# Altium schematic sheet sch2.SchDoc
size A3; SheetNumber: 1; SheetTotal: 1
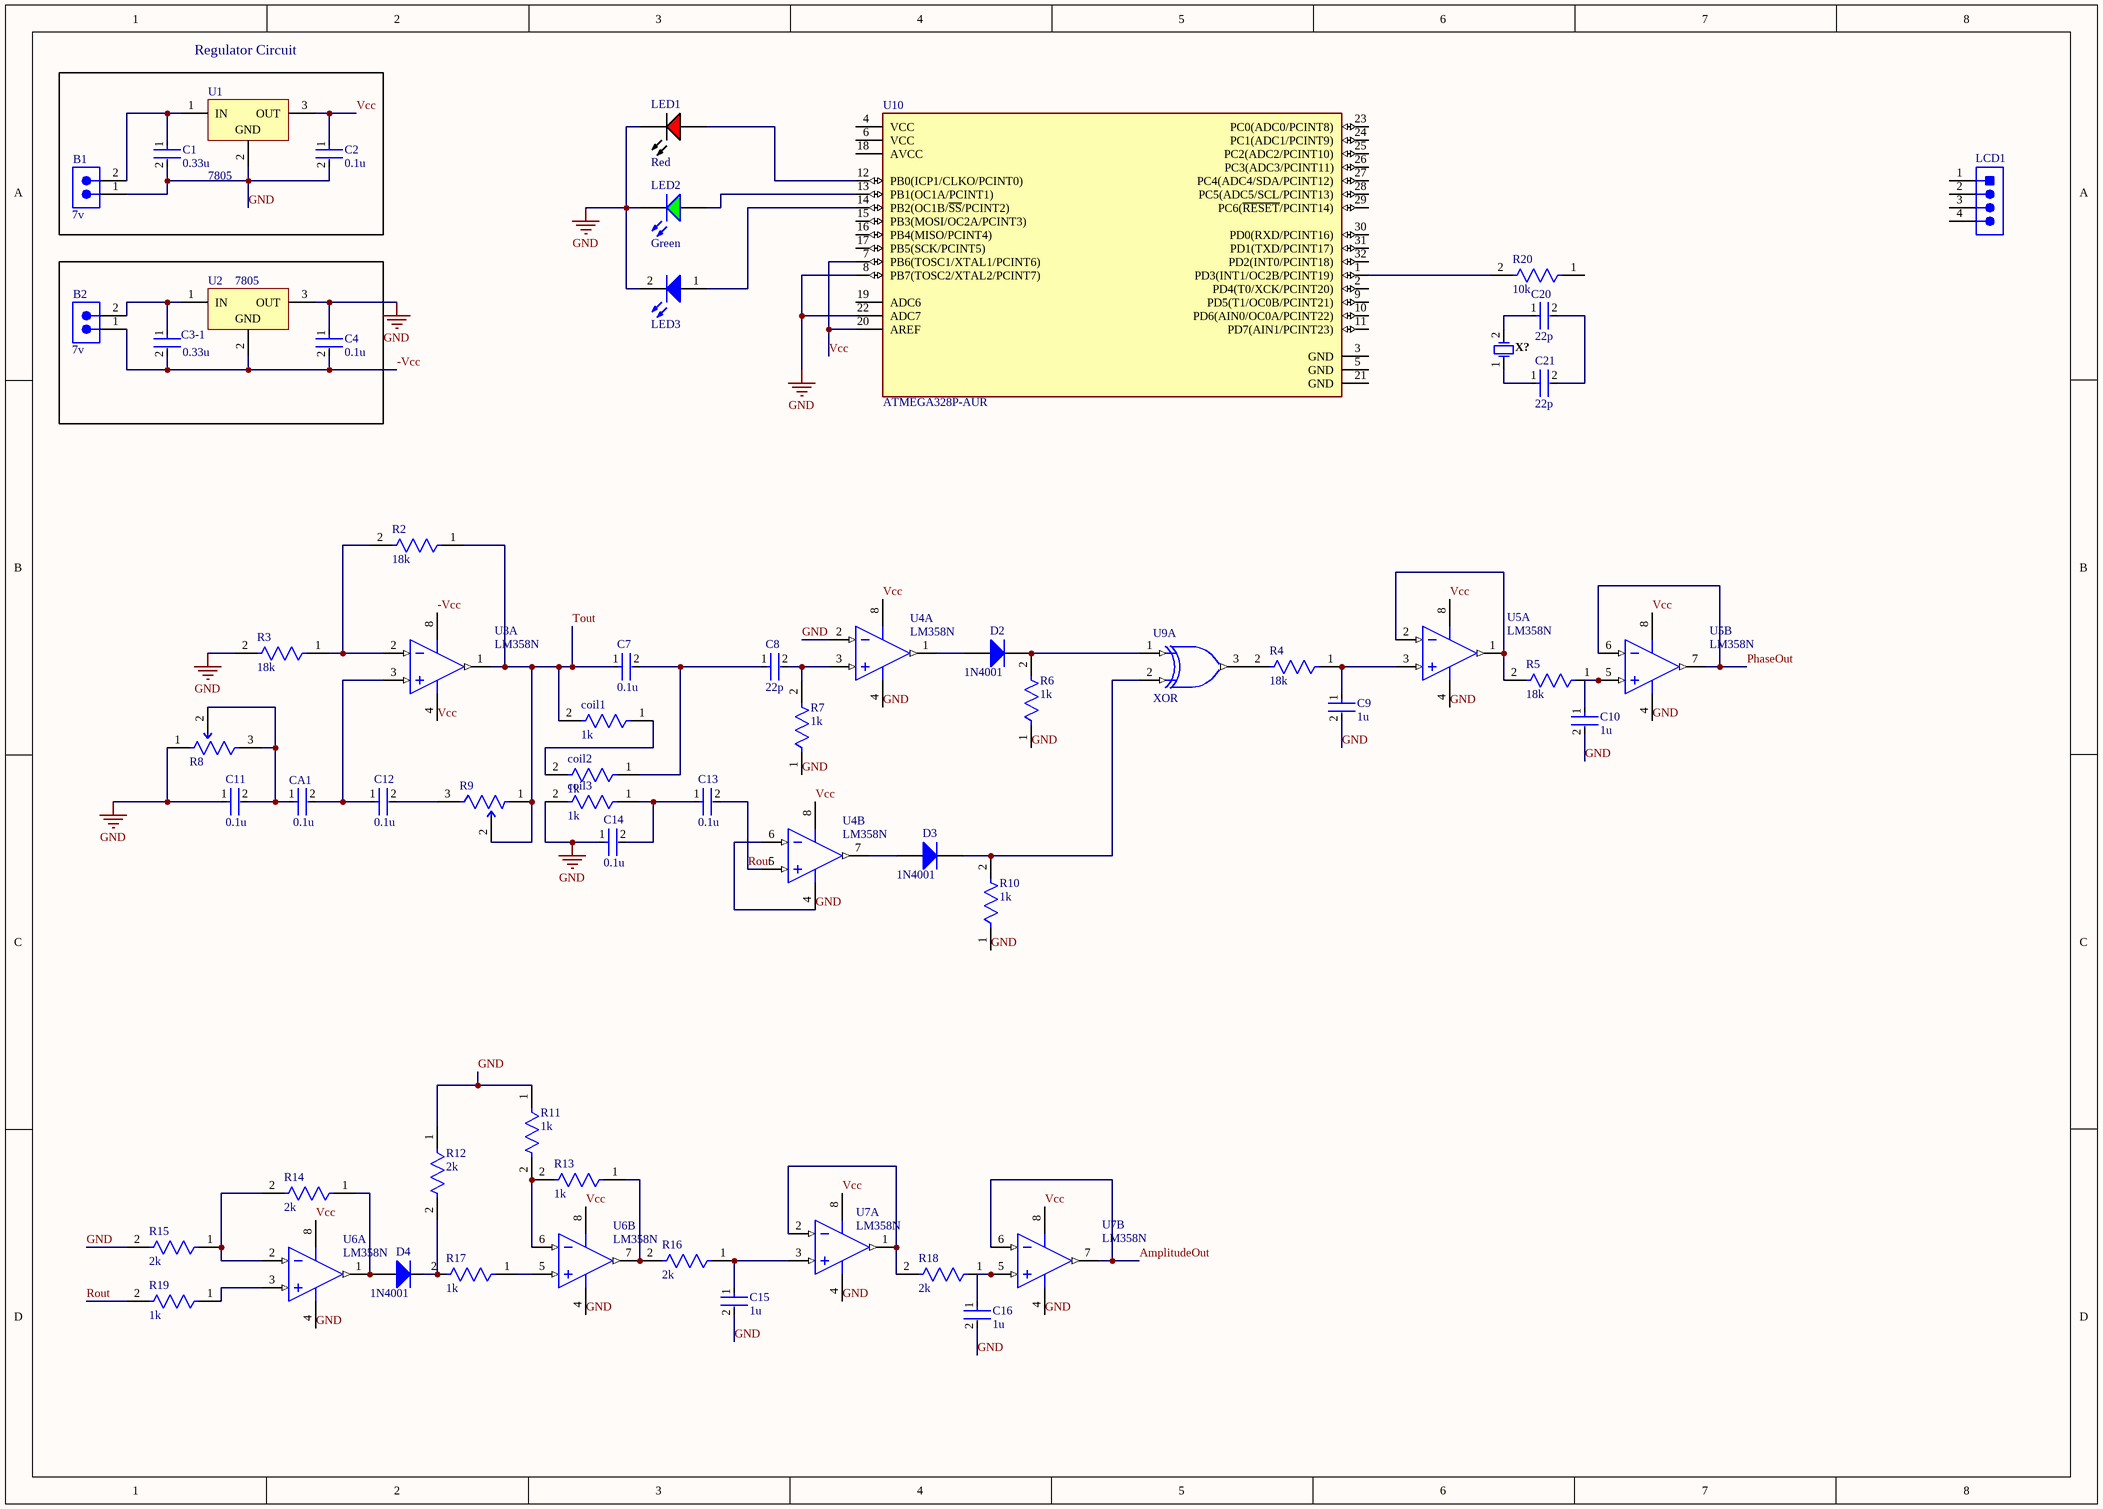
[diagram p0: sch2.SchDoc]

## Parts
B1  7v  [61300211121]
B2  7v  [61300211121]
C1  0.33u  [FP-RCE0K1-MFG]
C2  0.1u  [FP-RCE0K1-MFG]
C3-1  0.33u  [FP-RCE0K1-MFG]
C4  0.1u  [FP-RCE0K1-MFG]
C7  0.1u  [FP-RCE0K1-MFG]
C8  22p  [FP-RCE0K1-MFG]
C9  1u  [FP-RCE0K1-MFG]
C10  1u  [FP-RCE0K1-MFG]
C11  0.1u  [FP-RCE0K1-MFG]
C12  0.1u  [FP-RCE0K1-MFG]
C13  0.1u  [FP-RCE0K1-MFG]
C14  0.1u  [FP-RCE0K1-MFG]
C15  1u  [FP-RCE0K1-MFG]
C16  1u  [FP-RCE0K1-MFG]
C20  22p  [FP-RCE0K1-MFG]
C21  22p  [FP-RCE0K1-MFG]
CA1  0.1u  [FP-RCE0K1-MFG]
coil1  1k  [FP-MRS25-MFG]
coil2  1k  [FP-MRS25-MFG]
coil3  1k  [FP-MRS25-MFG]
D2  1N4001  [DIOD-DO-41-P-2_V]
D3  1N4001  [DIOD-DO-41-P-2_V]
D4  1N4001  [DIOD-DO-41-P-2_V]
LCD1  640456-4  [TECO-640456-4]  (value not drawn)
LED1  Red  [AVAG-HLMP-3301-2]
LED2  Green  [AVAG-HLMP-4740]
LED3  151051BS04000  [WL-TMRC_D5.9H8.7]  (value not drawn)
R2  18k  [FP-MRS25-MFG]
R3  18k  [FP-MRS25-MFG]
R4  18k  [FP-MRS25-MFG]
R5  18k  [FP-MRS25-MFG]
R6  1k  [FP-MRS25-MFG]
R7  1k  [FP-MRS25-MFG]
R8  3362P-1-104TLF  [FP-3362P-T-MFG]  (value not drawn)
R9  3362P-1-104TLF  [FP-3362P-T-MFG]  (value not drawn)
R10  1k  [FP-MRS25-MFG]
R11  1k  [FP-MRS25-MFG]
R12  2k  [FP-MRS25-MFG]
R13  1k  [FP-MRS25-MFG]
R14  2k  [FP-MRS25-MFG]
R15  2k  [FP-MRS25-MFG]
R16  2k  [FP-MRS25-MFG]
R17  1k  [FP-MRS25-MFG]
R18  2k  [FP-MRS25-MFG]
R19  1k  [FP-MRS25-MFG]
R20  10k  [FP-MRS25-MFG]
U1  7805  [TO220]
U2  7805  [TO220]
U3  LM358N  [N08E]  (part A of 2)
U4  LM358N  [P0008A]  (parts A,B of 2)
U5  LM358N  [P0008A]  (parts A,B of 2)
U6  LM358N  [P0008A]  (parts A,B of 2)
U7  LM358N  [P0008A]  (parts A,B of 2)
U9  XOR  [N0014A]  (part A of 5)
U10  ATMEGA328P-AUR  [FP-32A-MFG]
X?  FOXSLF/160-20  [FOX-FOXSLF160-20]  (value not drawn)

## Blocks framed on the sheet
Regulator Circuit: B1 C1 C2 U1

## Nets
GND: B1.1 C1.2 C2.2 C4.1 C9.2 C10.2 C11.1 C14.1 C15.2 C16.2 coil3.2 LED1.1(K) LED2.2(K) LED3.2(K) R3.2 R6.1 R7.1 R8.1(CCW) R10.1 R11.1 R12.1 R15.2 U1.2(GND) U2.3(OUT) U4.2(INA-) U4.4(GND) U4.6(INB-) U5.4(GND) U6.4(GND) U7.4(GND) U10.8(PB7(TOSC2/XTAL2/PCINT7)) U10.22(ADC7)
-Vcc: B2.1 C3-1.2 C4.2 U2.2(GND) U3.8(V+)
AmplitudeOut: U7.6(INB-) U7.7(OUTB)
PhaseOut: U5.6(INB-) U5.7(OUTB)
Rout: C13.2 R19.2 U4.5(INB+)
Tout: C7.1 coil1.2 R2.1 R9.1(CCW) R9.2(WIPER) U3.1(OUTA)
Vcc: C2.1 U1.3(OUT) U3.4(GND) U4.8(V+) U5.8(V+) U6.8(V+) U7.8(V+) U10.7(PB6(TOSC1/XTAL1/PCINT6)) U10.20(AREF)
NetB1_2: B1.2 C1.1 U1.1(IN)
NetB2_2: B2.2 C3-1.1 U2.1(IN)
NetC7_2: C7.2 C8.1 coil2.1
NetC8_2: C8.2 R7.2 U4.3(INA+)
NetC9_1: C9.1 R4.1 U5.3(INA+)
NetC10_1: C10.1 R5.1 U5.5(INB+)
NetC11_2: C11.2 CA1.1 R8.2(WIPER) R8.3(CW)
NetC12_1: C12.1 CA1.2 U3.3(INA+)
NetC12_2: C12.2 R9.3(CW)
NetC13_1: C13.1 C14.2 coil3.1
NetC15_1: C15.1 R16.1 U7.3(INA+)
NetC16_1: C16.1 R18.1 U7.5(INB+)
NetC20_1: C20.1 X?.2
NetC20_2: C20.2 C21.2
NetC21_1: C21.1 X?.1
Netcoil1_1: coil1.1 coil2.2
NetD2_1: D2.1(A) U4.1(OUTA)
NetD2_2: D2.2(K) R6.2 U9.1(A)
NetD3_1: D3.1(A) U4.7(OUTB)
NetD3_2: D3.2(K) R10.2 U9.2(B)
NetD4_1: D4.1(A) R14.1 U6.1(OUTA)
NetD4_2: D4.2(K) R12.2 R17.2
NetLED1_2: LED1.2(A) U10.12(PB0(ICP1/CLKO/PCINT0))
NetLED2_1: LED2.1(A) U10.13(PB1(OC1A/PCINT1))
NetLED3_1: LED3.1(A) U10.14(PB2(OC1B/~{SS}/PCINT2))
NetR2_2: R2.2 R3.1 U3.2(INA-)
NetR4_2: R4.2 U9.3(J)
NetR5_2: R5.2 U5.1(OUTA) U5.2(INA-)
NetR11_2: R11.2 R13.2 U6.6(INB-)
NetR13_1: R13.1 R16.2 U6.7(OUTB)
NetR14_2: R14.2 R15.1 U6.2(INA-)
NetR17_1: R17.1 U6.5(INB+)
NetR18_2: R18.2 U7.1(OUTA) U7.2(INA-)
NetR19_1: R19.1 U6.3(INA+)
NetR20_2: R20.2 U10.1(PD3(INT1/OC2B/PCINT19))

Not connected (* = marked no-connect by the designer): LCD1 1 2 3 4; R20 1; U10 2(PD4(T0/XCK/PCINT20)) 3(GND) 4(VCC) 5(GND) 6(VCC) 9(PD5(T1/OC0B/PCINT21)) 10(PD6(AIN0/OC0A/PCINT22)) 11(PD7(AIN1/PCINT23)) 15(PB3(MOSI/OC2A/PCINT3)) 16(PB4(MISO/PCINT4)) 17(PB5(SCK/PCINT5)) 18(AVCC) 19(ADC6) 21(GND) 23(PC0(ADC0/PCINT8)) 24(PC1(ADC1/PCINT9)) 25(PC2(ADC2/PCINT10)) 26(PC3(ADC3/PCINT11)) 27(PC4(ADC4/SDA/PCINT12)) 28(PC5(ADC5/SCL/PCINT13)) 29(PC6(~{RESET}/PCINT14)) 30(PD0(RXD/PCINT16)) 31(PD1(TXD/PCINT17)) 32(PD2(INT0/PCINT18))

## Library data of the parts
B1 B2 = CMP-1712-00002-5: NexarPartId: 20081794; Operating Supply Voltage: 250V; Current Rating: 3A; Gender: Male; Number of Contacts: 2; Pitch: 2.54mm; Connector Type: Male Pin; Contact Resistance: 20mΩ; Contact Plating: Gold; Contact Material: Copper; Number of Pins: 2; Min Operating Temperature: -40°C; Packaging: Bulk; Lead Pitch: 2.54mm; Mount: Through Hole; Orientation: Vertical; RoHS: Compliant; REACH SVHC: No SVHC; Height: 8.94mm; Termination: Through Hole; Number of Positions: 2; Contact Mating Length: 5.9944mm; Color: Black; Contact Gender: Male; Number of Rows: 1; Housing Material: PBT; Lead Free: Lead Free; Voltage Rating: 250V; Max Operating Temperature: 125°C
C1 C2 C3-1 C4 C7-C16 C20 C21 CA1 = CMP-06035-031280-1: Cap Ceramic 100nF 50V X7R ±10% Radial 5mm +125°C Automotive Bulk; Lead Diameter: 0.5mm; Lead/Base Style: Formed Leads; Min Operating Temperature: -55°C; Lead Free: Lead Free; Width: 0.098inch; Height - Seated (Max): 0.138inch; Voltage Rating: 50V; Voltage Rating (DC): 50V; Dielectric: X7R; Package Quantity: 2000; Case/Package: Radial; Capacitance: 100nF; Mount: Through Hole; Ratings: AEC-Q200; Tolerance: 10%; Max Operating Temperature: 125°C; Resistor Type: Ceramic; Height: 3.5mm; Length: 0.142inch; Termination: Radial; Packaging: Tape and Reel; Lead Pitch: 0.197inch
coil1-coil3 R2-R7 R10-R20 = CMP-00030-42757237-1: MRS25000C1000FRP00 Resistor, 100 Ohm, ± 1%, 600 mW, Axial Leaded, Metal Film (Thin Film), Professional; Max Power Dissipation: 600mW; Resistance: 100Ω; Voltage Rating: 350V; Temperature Coefficient: 50ppm/°C; Lead Diameter: 600µm; RoHS: Compliant; Radiation Hardening: No; Schedule B: 8533210090, 8533210090; Length: 6.5mm; Packaging: Tape & Reel (TR); Number of Terminations: 2; Mount: Through Hole; Width: 2.5mm; Tolerance: 1%; Military Standard: Not; Voltage Rating (DC): 350V; Contact Plating: Tin; Number of Pins: 2; Max Operating Temperature: 155°C; NexarPartId: 42757237; Diameter: 2.5mm; Composition: Metal Film, Thin Film; REACH SVHC: Unknown; Power Rating: 600mW; Lead Free: Lead Free; Termination: Axial; Case/Package: Axial; Min Operating Temperature: -55°C
D2-D4 = CMP-0639-00006-2: 1.0 A Rectifier, 15 pF, 50 V, -65 to 150 degC, 2-Pin DO-41 Plastic, RoHS, Tape and Reel; PartNumber: 1N4001-T; Manufacturer: Diodes Inc; VF (V): 1; CT (pF): 15; Max. IR (uA): 5; VRRM (V): 50; Max. IFSM (A): 30; RoHS: TRUE; Mounting Technology: Through Hole; ComponentLink2Description: Datasheet; DatasheetVersion: Rev. 8-2; Operating Temperature Range (degC): -65 to 150; Packing: Tape and Reel; PackageReference: DO-41-P-2; ComponentLink1URL: http://diodes.com/; PackageDescription: 2-Pin Axial Lead, Body 4.635 x 2.36 mm, Lead Spread 25.4 mm; ComponentLink2URL: http://diodes.com/datasheets/ds28002.pdf; Max. Average Rectified Current IO (A): 1; ComponentLink1Description: Manufacturer URL
LCD1 = CMP-2000-05419-1: Male Header, Pitch 2.54 mm, 1 x 4 Position, Height 10.03 mm, Tail Length 3.56 mm, RoHS, Bulk; Manufacturer: TE Connectivity; Material, Housing: Polyester; Primary Type: InterconnectSystem; Mount Angle: Vertical; Color, Housing: White; Current, Rating: 5 / A; Agency Approvals: CSA,UL; Contact Termination Area Plating: Tin; Temperature, Operating: -55to+105 / degC; Standards: RoHSCompliant,ELVCompliant,UL94V-0; Number of Positions: 4; Brand/Series: MTA-100Series; Angle: Straight; Pin Spacing: 0.1 / "; Material, Contact: CopperAlloy; Connector Type: MTA-100; Special Features: Pinstrip; Mounting Hole Size: 0.04 / "; Contact Centerline Spacing: 0.100 / in.; Voltage, Rating: 250 / V; Manufacturer URL: http://www.te.com/; Length, Pin: 0.14 / "; Length, Overall: 0.4 / "; Color: White; Flammability Rating: UL94V-0; Mounting Type: PCMount; Termination: Solder; Datasheet URL: https://datasheet.ciiva.com/16286/eng-ds-82056-mta-0608-16286228.pdf; Number of Contacts: 4; Contact Shape: Square; Contact Mating Area Plating: Tin; Length, Terminal Post: 0.14 / in.; Size, Post: 0.025 / in.; Contact Plating: Tin; Type: PCBPlug; Datasheet Version: Dec-14; Number of Rows: 1
LED1 = CMP-2000-06411-1: T-1 3/4 (5 mm) Diffused LED Lamp, 1.9 V, -40 to 100 degC, 2-Pin THD, RoHS, Bulk; Manufacturer: Avago; Forward Current: 25mA; Forward Voltage: 2.4V; Peak Wavelength: 635nm; Shape Type: Circular; High Brightness: No; Main Category: StandardLED; Test Current (It): 10mA; Dominant Wave Length: 626nm; Number of  Elements: 1; Reverse Voltage: 5V; Chip Material: GaP; Product Height (mm): 9.19mm; Lens Type: ColoredDiffused; Viewing Angle: 60deg; Type: Uni-Color; Luminous Intensity: 5.4mcd; Power Dissipation: 85W; DELETED: Compliant; Product Depth (mm): 6.1mm; Package Description: 2-Pin Through Hole LED, Dia 5.85 mm; Mounting Technology: ThroughHole; Manufacturer URL: http://www.avagotech.com/; Package Type: T-13/4; Operating Temp Range: -40Cto100C; Datasheet URL: http://www.avagotech.com/docs/AV02-1558EN; Mounting: ThroughHole; Lens Dimensions: 5.08x5.08x8.3mm; Package Reference: HLMP-3301; Datasheet Version: 03/2015; Pin Count: 2; Packaging: TapeandReel; Emitting Color: Red; Operating Temperature Classification: Industrial; Lum Intensity: 5.4mcd; Rad Hardened: No; Product Length (mm): 6.1mm
LED2 = CMP-2000-06413-1: T-1 3/4 (5 mm) Low Current LED Lamp, Green, 1.9 V, -20 to 100 degC, 2-Pin THD, RoHS, Bulk; Manufacturer: AvagoTechnologies; Type: Uni-Color; Peak Wavelength: 565nm; Rad Hard: No; Viewing Angle: 50°; Dominant Wavelength/Color Temperature: 569nm; Number of LEDs: 1; Lens Appearance: ColoredDiffused; Lens Shape Type: Circular; Mounting Orientation: TopMount; Intensity: 2.3mcd; Datasheet Version: 07/2014; Category: LEDs; Datasheet URL: http://docs.avagotech.com/docs/AV02-1557EN; Packaging: Bulk; Pin Count: 2; Mounting Technology: ThroughHole; Package Reference: HLMP-4740; Mounting: ThroughHole; Manufacturer URL: http://www.avagotech.com/; Color: Green; Package: 2T-13/4; Package Description: 2-Pin Through Hole Device, Dia 5.845 mm, Pitch 2.54 mm
LED3 = CMP-1488-00009-2: NexarPartId: 29717812; Test Current: 20mA; Forward Voltage: 3.2V; Wavelength: 470nm; Lens Size: 5mm; Lens Style: Circular, Diffused, Round; Forward Current: 100mA; Peak Wavelength: 465nm; Viewing Angle: 40°; Luminous Intensity: 500mcd; Max Reverse Voltage (DC): 5V; Color: Blue; Case/Package: Radial; Width: 5mm; Mount: Through Hole; Min Operating Temperature: -40°C; Length: 5mm; Height: 8.6mm; Max Operating Temperature: 85°C; Packaging: Bulk; RoHS: Compliant; REACH SVHC: Unknown; Dominant Wavelength: 470nm
R8 R9 = CMP-07234-000031-1: TRIMMER 100K OHM 0.5W PC PIN TOP; Max Power Dissipation: 500mW; Temperature Coefficient: 100ppm/°C; Resistance: 100kR; Tolerance: 10%; Termination: PC Pin; Width: 0.26inch; RoHS Compliant: Yes; Power Rating: 500mW; Technology: CERMET; Mount: Through Hole; Length: 0.275inch; Resistor Type: Cermet; Package Quantity: 50; Height: 0.185inch; Series: Trimpot® 3362 - Sealed; Max Operating Temperature: 125°C; Packaging: Rail/Tube; Min Operating Temperature: -55°C
U1 U2 = CMP-0244-00483-1: Positive Voltage Regulator, 5V, 3-Pin TO-220; PackageDescription: TO, Thru-Hole, Vertical, Heatsink Mounted; 3 In-Line Leads; Pitch 2.54 mm; ComponentLink2Description: Datasheet; PackageReference: TO220; ComponentLink3URL: http://www.st.com/internet/com/TECHNICAL_RESOURCES/TECHNICAL_LITERATURE/PACKAGE_INFORMATION/CD00004649.pdf; DatasheetVersion: 16/11/2011; ComponentLink1Description: Manufacturer URL; ComponentLink1URL: http://www.st.com; PackageVersion: ver3.0; ComponentLink3Description: Package Specification; ComponentLink2URL: http://www.st.com/internet/com/TECHNICAL_RESOURCES/TECHNICAL_LITERATURE/DATASHEET/CD00000444.pdf
U3 = CMP-0055-00154-2: Low Power Dual Operational Amplifier, 8-pin MDIP; Manufacturer: National Semiconductor; PackageTopMarking: NSUZXYTTE#*LM*358N; CompType: Amplifiers; PowerWise: N; ComponentLink3Description: N08E Package Page; PackageVersion: revG, May-2006; ComponentLink2URL: http://www.national.com/pf/LM/LM358.html; RevisionNote: Component URLs added; DatasheetVersion: Oct-2005; PinCount: 8; ComponentLink1URL: http://www.national.com/ds/LM/LM358.pdf; ComponentLink1Description: LM358 Datasheet; Code_JEDEC: MS-001-BA; PackageDescription: MDIP, .365 x .250 x .130in, 8 Lead, .100in Pitch; PackageReference: N08E; ComponentLink3URL: http://www.national.com/packaging/folders/n08e.html; ComponentLink2Description: LM358 Web Page; RoHS: N
U4-U7 = CMP-0055-00153-3: Low Power Dual Operational Amplifier, 8-pin MDIP, Pb-Free; Manufacturer: Texas Instruments; PowerWise: N; PackageTopMarking: NSUZXYTTE#*LM*358N; CompType: Amplifiers; Package Reference: P0008A; PinCount: 8; ComponentLink1URL: http://www.ti.com/general/docs/lit/getliterature.tsp?genericPartNumber=LM358-N&fileType=pdf; Code_JEDEC: MS-001-BA; PackageDescription: MDIP, .365 x .250 x .130in, 8 Lead, .100in Pitch; RoHS: Y; ComponentLink1Description: Datasheet URL
U9 = CMP-0778-00110-3: CMOS Quad Exclusive-OR Gate, N0014A, TUBE; Manufacturer: Texas Instruments; Generic Part Number: CD4030B; Technology Family: CD4000; Schmitt Trigger: No; VCC(Min)(V): 3; Rating: Military; Voltage(Nom)(V): 10; tpd @ Nom Voltage(Max)(ns): 130; VCC(Max)(V): 18; F @ Nom Voltage(Max)(Mhz): 8; Bits(#): 4; Output Drive (IOL/IOH)(Max)(mA): 1.5/-1.5; ICC @ Nom Voltage(Max)(mA): 0.015; Operating Temperature Range(C): -55 to 125; Input Type: CMOS; DatasheetVersion: SCHS035C; PackageReference: N0014A; Output Type: CMOS
U10 = CMP-06276-000046-1: IC MCU 8BIT 32KB FLASH 32TQFP; Number of I/Os: 32; Oscillator Type: Internal; Peripherals: Brown-out Detect/Reset; Core Architecture: PIC; Interface: I2C; Frequency: 40MHz; Case/Package: TQFP; Max Operating Temperature: 85°C; Min Operating Temperature: -40°C; Memory Size: 32KB; Packaging: Cut Tape; Memory Type: FLASH
X? = CMP-1749-00003-1: Resistance Weld Thru-Hole Crystal, 16 MHz, -20 to 70 degC, 2-Pin THD, RoHS, Bulk; Voltage Rating: 250 V; Tolerance: 1%; Resistance: 221 kohm; Case\Package: Axial; Power Rating: 250 mW; RoHSCompliant: true; Package Quantity: 200; Packaging: Bulk; Min Operating Temperature: -55 degC; DatasheetVersion: Mar-15; ComponentLink1URL: http://www.foxonline.com/; Max Operating Temperature: 155 degC; PackageReference: FOXSLF160-20; Mount: Through Hole; PackageDescription: 2-Pin Through Hole Device, Body 11.35 x 4.65 mm; ComponentLink1Description: Manufacturer URL; ComponentLink2URL: http://www.foxonline.com/pdfs/hc49slf.pdf; ComponentLink2Description: Datasheet; Length: 0.248 inch